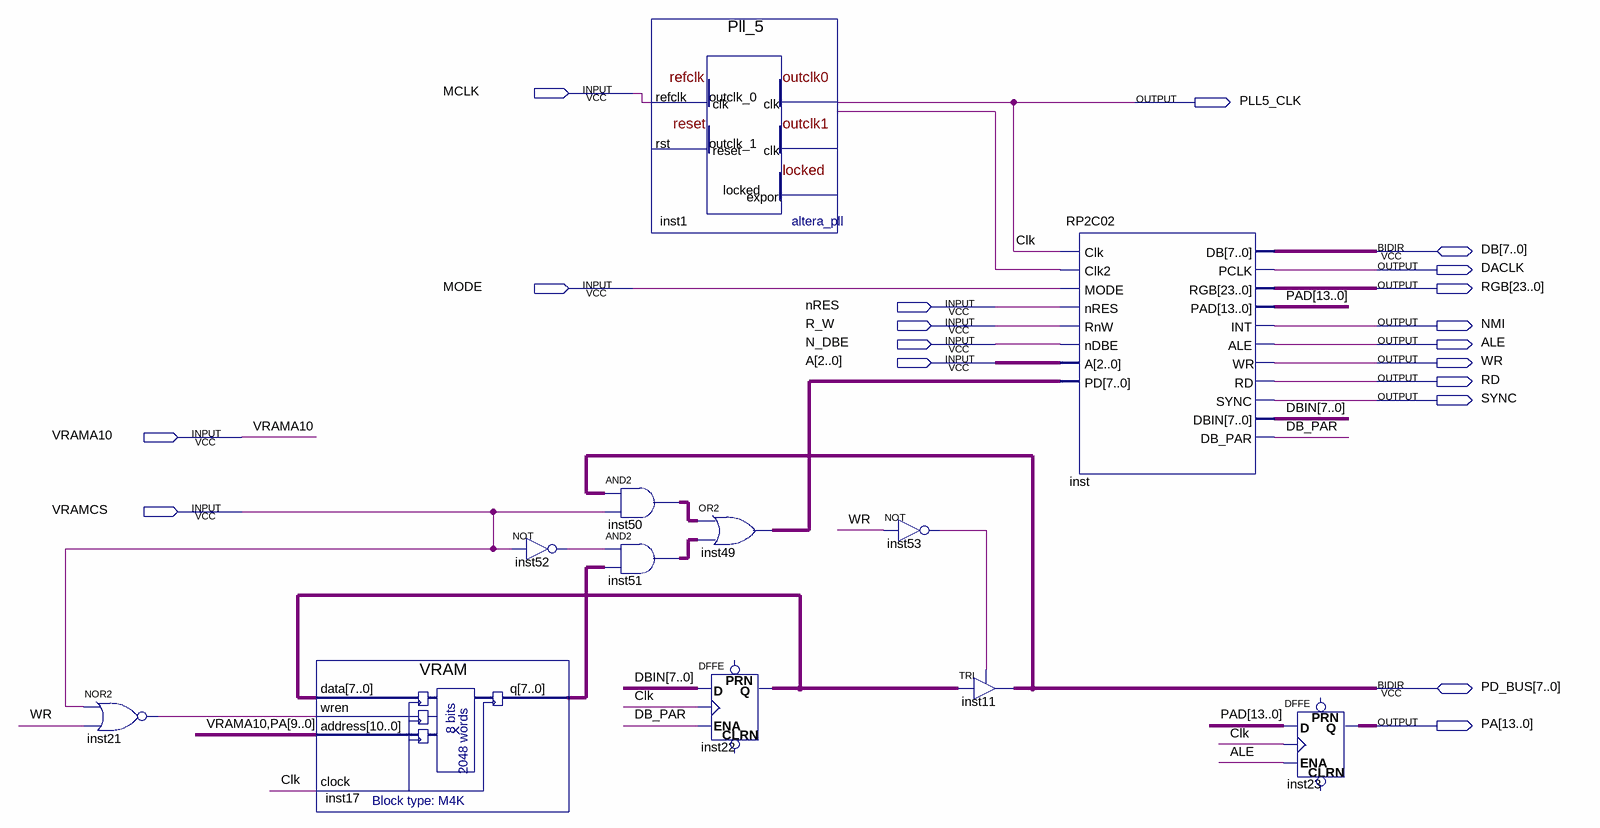
[diagram p0: schematic sheet]
// Quartus schematic V1.bdf as structural Verilog: 12 symbols, 19 pins
module V1 (
  input  MCLK,
  input  MODE,
  input  nRES,
  input  R_W,
  input  N_DBE,
  input  [2:0] A,
  input  VRAMA10,
  input  VRAMCS,
  inout  [7:0] DB,
  inout  [7:0] PD_BUS,
  output PLL5_CLK,
  output DACLK,
  output [23:0] RGB,
  output NMI,
  output ALE,
  output WR,
  output RD,
  output SYNC,
  output [13:0] PA
);

  wire DB_PAR, inst1_outclk_1, inst21_out, inst52_out, inst53_out;
  wire [7:0] DBIN, inst17_q, inst22_q, inst49_out, inst50_out, inst51_out;
  wire [13:0] PAD;

  nor inst21 (inst21_out, VRAMCS, WR);
  VRAM inst17 (.data(inst22_q), .wren(inst21_out), .address({VRAMA10, PA[9:0]}), .clock(PLL5_CLK), .q(inst17_q));
  not inst52 (inst52_out, VRAMCS);
  Pll_5 inst1 (.refclk(MCLK), .outclk_0(PLL5_CLK), .outclk_1(inst1_outclk_1));  // open: rst, locked
  assign inst50_out = PD_BUS & {8{VRAMCS}};  // AND2 inst50, 8 bits wide
  assign inst51_out = {8{inst52_out}} & inst17_q;  // AND2 inst51, 8 bits wide
  assign inst49_out = inst50_out | inst51_out;  // OR2 inst49, 8 bits wide
  DFFE inst22[7:0] (.D(DBIN), .CLK(PLL5_CLK), .ENA(DB_PAR), .Q(inst22_q));  // open: PRN, CLRN
  not inst53 (inst53_out, WR);
  TRI inst11[7:0] (.IN(inst22_q), .OE(inst53_out), .OUT(PD_BUS));
  RP2C02 inst (
    .Clk(PLL5_CLK), .Clk2(inst1_outclk_1), .MODE(MODE), .nRES(nRES), .RnW(R_W), .nDBE(N_DBE), .A(A),
    .PD(inst49_out), .PCLK(DACLK), .RGB(RGB), .PAD(PAD), .INT(NMI), .ALE(ALE), .WR(WR), .RD(RD), .SYNC(SYNC),
    .DBIN(DBIN), .DB_PAR(DB_PAR), .DB(DB));
  DFFE inst23[13:0] (.D(PAD), .CLK(PLL5_CLK), .ENA(ALE), .Q(PA));  // open: PRN, CLRN

  // Other names for the same wires on the sheet: Clk = PLL5_CLK
endmodule
